# EAGLE design arduino_breakout (EAGLE 6.1)
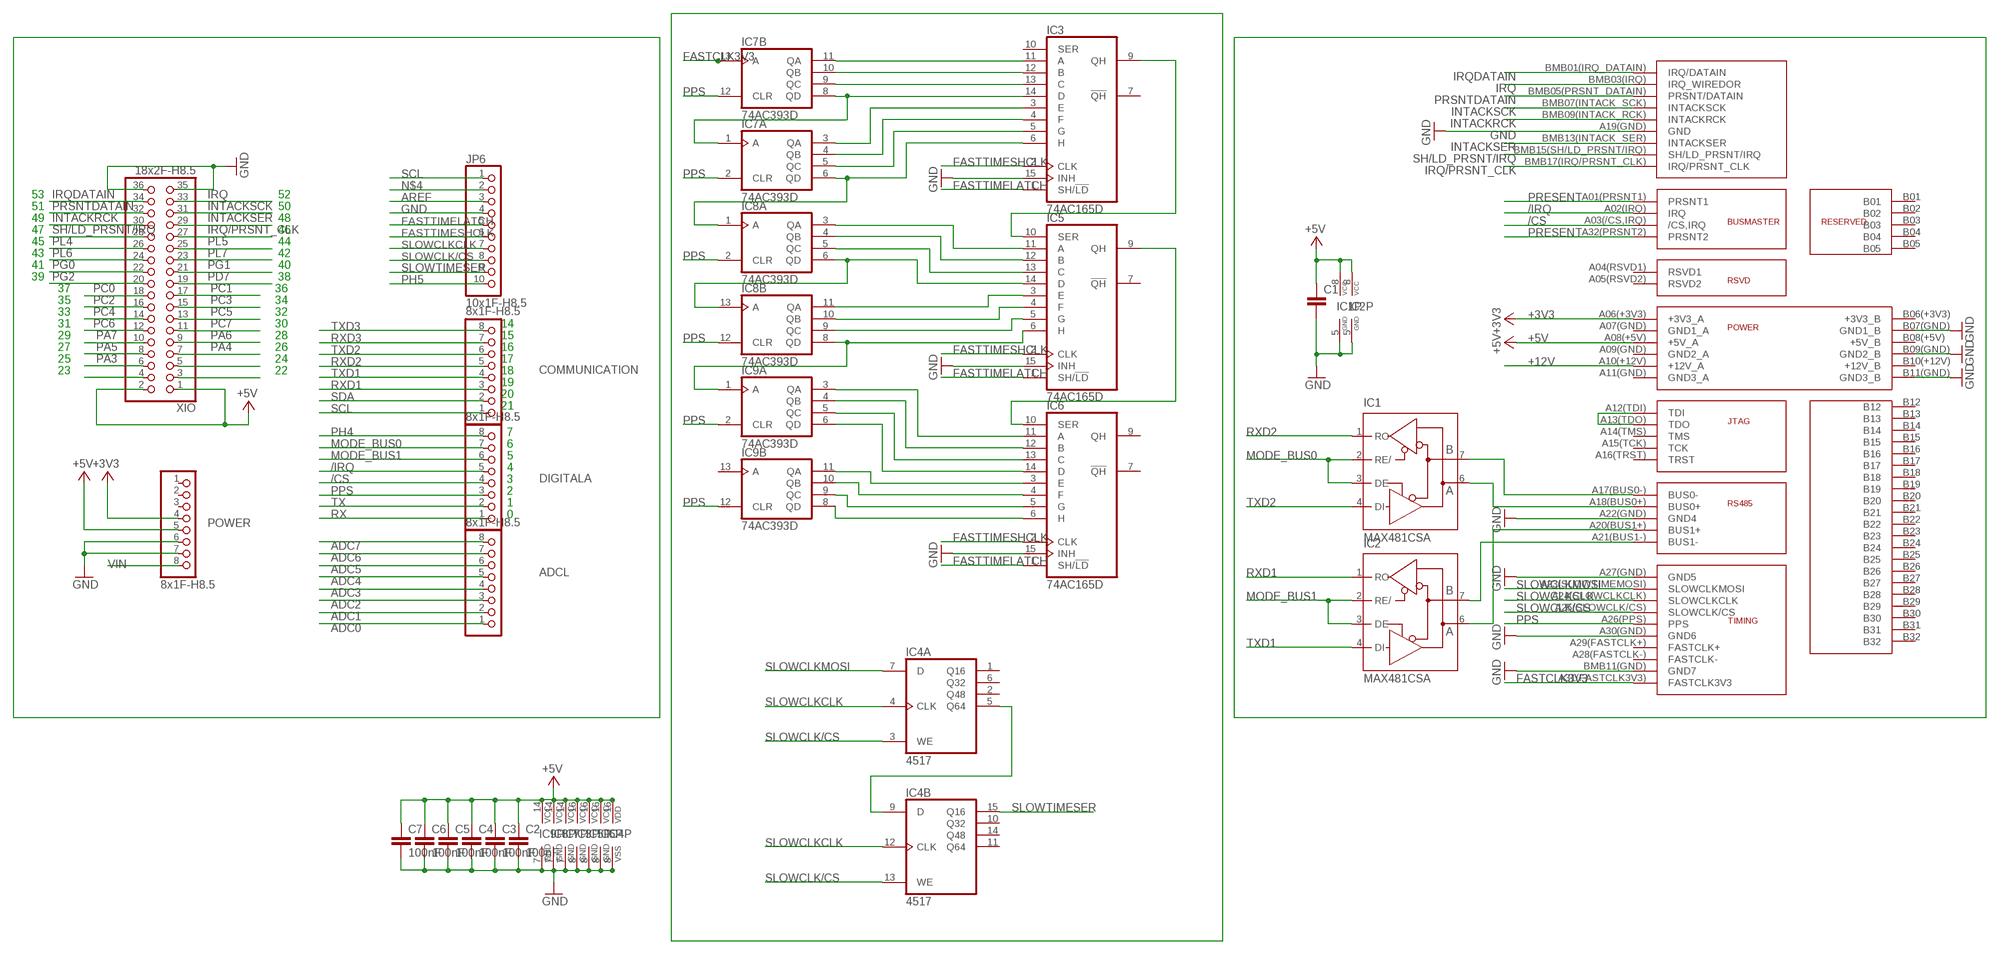
[diagram p0: schematic, sheet 1]

## Parts
ADCL  8x1F-H8.5  PINHD-1X8  [1X08]
C1  C-EUC0603  [C0603]
C2  100nF  C-EUC0603  [C0603]
C3  100nF  C-EUC0603  [C0603]
C4  100nF  C-EUC0603  [C0603]
C5  100nF  C-EUC0603  [C0603]
C6  100nF  C-EUC0603  [C0603]
C7  100nF  C-EUC0603  [C0603]
COMMUNICATION  8x1F-H8.5  PINHD-1X8  [1X08]
DIGITALA  8x1F-H8.5  PINHD-1X8  [1X08]
IC1  MAX481CSA  [SO08]
IC2  MAX481CSA  [SO08]
IC3  74AC165D  [SO16]
IC4  4517  [SO16]
IC5  74AC165D  [SO16]
IC6  74AC165D  [SO16]
IC7  74AC393D  [SO14]
IC8  74AC393D  [SO14]
IC9  74AC393D  [SO14]
JP6  10x1F-H8.5  PINHD-1X10_ARD  [1X10]
POWER  8x1F-H8.5  PINHD-1X8  [1X08]
U$1  BUSMASTER  [BUSMASTER_EDGE_CONNECTOR]
XIO  18x2F-H8.5  PINHD-2X18  [2X18]

## Nets
+3V3 [power]: POWER.4 U$1.A06(+3V3)(+3V3_A)
+5V [power usb]: C1.1 C2.1 C3.1 C4.1 C5.1 C6.1 C7.1 IC1.8(VCC) IC2.8(VCC) IC3.16(VCC) IC4.16(P:VDD) IC5.16(VCC) IC6.16(VCC) IC7.14(P:VCC) IC8.14(P:VCC) IC9.14(P:VCC) POWER.5 U$1.A08(+5V)(+5V_A) XIO.1 XIO.2
+12V [power usb]: U$1.A10(+12V)(+12V_A)
/CS: DIGITALA.4 U$1.A03(/CS,IRQ)(/CS,IRQ)
/IRQ: DIGITALA.5 U$1.A02(IRQ)(IRQ)
ADC0: ADCL.1
ADC1: ADCL.2
ADC2: ADCL.3
ADC3: ADCL.4
ADC4: ADCL.5
ADC5: ADCL.6
ADC6: ADCL.7
ADC7: ADCL.8
AREF: JP6.3
FASTCLK3V3: IC7.13(B:A) U$1.A31(FASTCLK3V3)(FASTCLK3V3)
FASTTIMELATCH: IC3.1(SH/!LD) IC5.1(SH/!LD) IC6.1(SH/!LD) JP6.5
FASTTIMESHCLK: IC3.2(CLK) IC5.2(CLK) IC6.2(CLK) JP6.6
GND [gnd]: C1.2 C2.2 C3.2 C4.2 C5.2 C6.2 C7.2 IC1.5(GND) IC2.5(GND) IC3.8(GND) IC3.15(INH) IC4.8(P:VSS) IC5.8(GND) IC5.15(INH) IC6.8(GND) IC6.15(INH) IC7.7(P:GND) IC8.7(P:GND) IC9.7(P:GND) JP6.4 POWER.6 POWER.7 U$1.A19(GND)(GND) U$1.A22(GND)(GND4) U$1.A27(GND)(GND5) U$1.A30(GND)(GND6) U$1.B07(GND)(GND1_B) U$1.B09(GND)(GND2_B) U$1.B11(GND)(GND3_B) U$1.BMB11(GND)(GND7) XIO.35 XIO.36
INTACKRCK: U$1.BMB09(INTACK_RCK)(INTACKRCK) XIO.30
INTACKSCK: U$1.BMB07(INTACK_SCK)(INTACKSCK) XIO.31
INTACKSER: U$1.BMB13(INTACK_SER)(INTACKSER) XIO.29
IRQ: U$1.BMB03(IRQ)(IRQ_WIREDOR) XIO.33
IRQ/PRSNT_CLK: U$1.BMB17(IRQ/PRSNT_CLK)(IRQ/PRSNT_CLK) XIO.27
IRQDATAIN: U$1.BMB01(IRQ_DATAIN)(IRQ/DATAIN) XIO.34
MODE_BUS0: DIGITALA.7 IC1.2(RE/) IC1.3(DE)
MODE_BUS1: DIGITALA.6 IC2.2(RE/) IC2.3(DE)
N$1: U$1.A12(TDI)(TDI) U$1.A13(TDO)(TDO)
N$2: IC1.7(B) U$1.A17(BUS0-)(BUS0-)
N$3: IC1.6(A) U$1.A18(BUS0+)(BUS0+)
N$4: JP6.2
N$5: IC2.7(B) U$1.A21(BUS1-)(BUS1-)
N$6: IC2.6(A) U$1.A20(BUS1+)(BUS1+)
N$10: IC7.1(A:A) IC7.8(B:QD)
N$11: IC3.13(C) IC7.9(B:QC)
N$12: IC3.12(B) IC7.10(B:QB)
N$13: IC3.11(A) IC7.11(B:QA)
N$14: IC3.3(E) IC7.3(A:QA)
N$15: IC3.4(F) IC7.4(A:QB)
N$16: IC3.5(G) IC7.5(A:QC)
N$17: IC3.6(H) IC7.6(A:QD) IC8.1(A:A)
N$18: XIO.5
N$19: IC6.6(H) IC9.8(B:QD)
N$20: IC6.5(G) IC9.9(B:QC)
N$21: IC6.4(F) IC9.10(B:QB)
N$22: IC6.3(E) IC9.11(B:QA)
N$23: IC6.14(D) IC9.6(A:QD)
N$24: IC6.13(C) IC9.5(A:QC)
N$25: IC6.12(B) IC9.4(A:QB)
N$26: IC6.11(A) IC9.3(A:QA)
N$27: IC5.6(H) IC8.8(B:QD) IC9.1(A:A)
N$28: IC5.5(G) IC8.9(B:QC)
N$29: IC5.4(F) IC8.10(B:QB)
N$30: IC5.3(E) IC8.11(B:QA)
N$31: IC5.14(D) IC8.6(A:QD) IC8.13(B:A)
N$32: IC5.13(C) IC8.5(A:QC)
N$33: IC4.5(A:Q64) IC4.9(B:D)
N$34: IC3.9(QH) IC5.10(SER)
N$35: IC5.12(B) IC8.4(A:QB)
N$36: IC5.9(QH) IC6.10(SER)
N$37: IC5.11(A) IC8.3(A:QA)
N$38: XIO.3
N$39: XIO.4
PA3: XIO.6
PA4: XIO.7
PA5: XIO.8
PA6: XIO.9
PA7: XIO.10
PC0: XIO.18
PC1: XIO.17
PC2: XIO.16
PC3: XIO.15
PC4: XIO.14
PC5: XIO.13
PC6: XIO.12
PC7: XIO.11
PD7: XIO.19
PG0: XIO.22
PG1: XIO.21
PG2: XIO.20
PH4: DIGITALA.8
PH5: JP6.10
PL4: XIO.26
PL5: XIO.25
PL6: XIO.24
PL7: XIO.23
PPS: DIGITALA.3 IC7.2(A:CLR) IC7.12(B:CLR) IC8.2(A:CLR) IC8.12(B:CLR) IC9.2(A:CLR) IC9.12(B:CLR) U$1.A26(PPS)(PPS)
PRESENT: U$1.A01(PRSNT1)(PRSNT1) U$1.A32(PRSNT2)(PRSNT2)
PRSNTDATAIN: U$1.BMB05(PRSNT_DATAIN)(PRSNT/DATAIN) XIO.32
RX: DIGITALA.1
RXD1: COMMUNICATION.3 IC2.1(RO)
RXD2: COMMUNICATION.5 IC1.1(RO)
RXD3: COMMUNICATION.7
SCL: COMMUNICATION.1 JP6.1
SDA: COMMUNICATION.2
SH/LD_PRSNT/IRQ: U$1.BMB15(SH/LD_PRSNT/IRQ)(SH/LD_PRSNT/IRQ) XIO.28
SLOWCLK/CS: IC4.3(A:WE) IC4.13(B:WE) JP6.8 U$1.A25(SLOWCLK/CS)(SLOWCLK/CS)
SLOWCLKCLK: IC4.4(A:CLK) IC4.12(B:CLK) JP6.7 U$1.A24(SLOWCLKCLK)(SLOWCLKCLK)
SLOWCLKMOSI: IC4.7(A:D) U$1.A23(SLOWTIMEMOSI)(SLOWCLKMOSI)
SLOWTIMESER: IC4.15(B:Q16) JP6.9
TX: DIGITALA.2
TXD1: COMMUNICATION.4 IC2.4(DI)
TXD2: COMMUNICATION.6 IC1.4(DI)
TXD3: COMMUNICATION.8
VIN [power]: POWER.8
Unconnected: IC3.7(!QH) IC3.10(SER) IC3.14(D) IC4.1(A:Q16) IC4.2(A:Q48) IC4.6(A:Q32) IC4.10(B:Q32) IC4.11(B:Q64) IC4.14(B:Q48) IC5.7(!QH) IC6.7(!QH) IC6.9(QH) IC9.13(B:A) POWER.1 POWER.2 POWER.3 U$1.A04(RSVD1)(RSVD1) U$1.A05(RSVD2)(RSVD2) U$1.A07(GND)(GND1_A) U$1.A09(GND)(GND2_A) U$1.A11(GND)(GND3_A) U$1.A14(TMS)(TMS) U$1.A15(TCK)(TCK) U$1.A16(TRST)(TRST) U$1.A28(FASTCLK-)(FASTCLK-) U$1.A29(FASTCLK+)(FASTCLK+) U$1.B01 U$1.B02 U$1.B03 U$1.B04 U$1.B05 U$1.B06(+3V3)(+3V3_B) U$1.B08(+5V)(+5V_B) U$1.B10(+12V)(+12V_B) U$1.B12 U$1.B13 U$1.B14 U$1.B15 U$1.B16 U$1.B17 U$1.B18 U$1.B19 U$1.B20 U$1.B21 U$1.B22 U$1.B23 U$1.B24 U$1.B25 U$1.B26 U$1.B27 U$1.B28 U$1.B29 U$1.B30 U$1.B31 U$1.B32

## Notes on the sheet
- 53 | 52
- 51 | 50
- 49 | 48
- 47 | 46
- 45 | 44
- 43 | 42
- 41 | 40
- 39 | 38
- 37 | 36
- 35 | 34
- 33 | 32
- 31 | 30 | 14
- 29 | 28 | 15
- 27 | 26 | 16
- 25 | 24 | 17
- 23 | 22 | 18
- 19
- 20
- 21
- 7
- 6
- 5
- 4
- 3
- 2
- 1
- 0

## Library data of the parts
ADCL COMMUNICATION DIGITALA POWER = SmartPrj:PINHD-1X8: PIN HEADER
C1-C7 = rcl:C-EU: CAPACITOR, European symbol
IC1 IC2 = maxim:MAX481CSA: RS485 TRANSEIVER; MF: MAXIM; MPN: MAX481CSA; OC_FARNELL: unknown; OC_NEWARK: 90C3817
IC3 IC5 IC6 = 74xx-eu:74*165: 8-bit parallel load SHIFT REGISTER
IC4 = 45xx:4517: Dual 64-bit static REGISTER
IC7-IC9 = 74xx-eu:74*393: Dual 4-bit decade and binary COUNTER
JP6 = SmartPrj:PINHD-1X10_ARD: PIN HEADER
U$1 = hgg:BUSMASTER
XIO = SmartPrj:PINHD-2X18: PIN HEADER

## Net classes
0 default: width 0.203 mm, drill 0.406 mm, clearance 0.203 mm
1 power: width 0.61 mm, drill 0.406 mm, clearance 0.203 mm
2 gnd: width 0.305 mm, drill 0.406 mm, clearance 0.203 mm
3 power usb: width 0.508 mm, drill 0.406 mm, clearance 0.203 mm

## Board
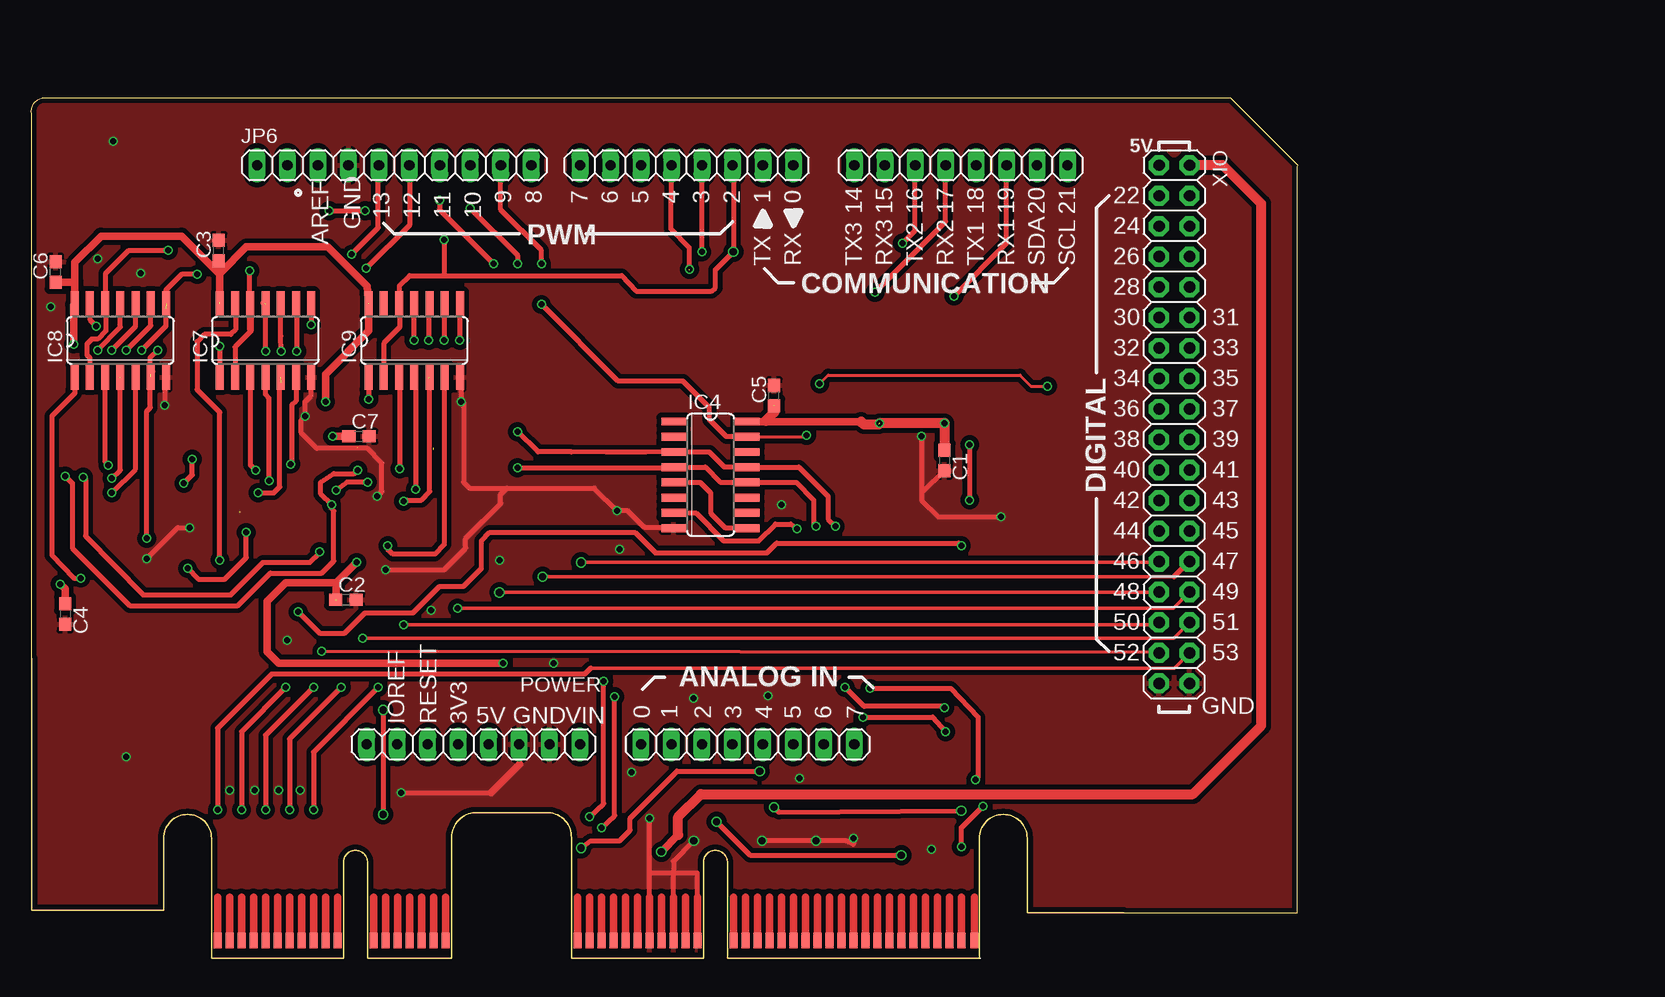
[diagram p1: board, top side]
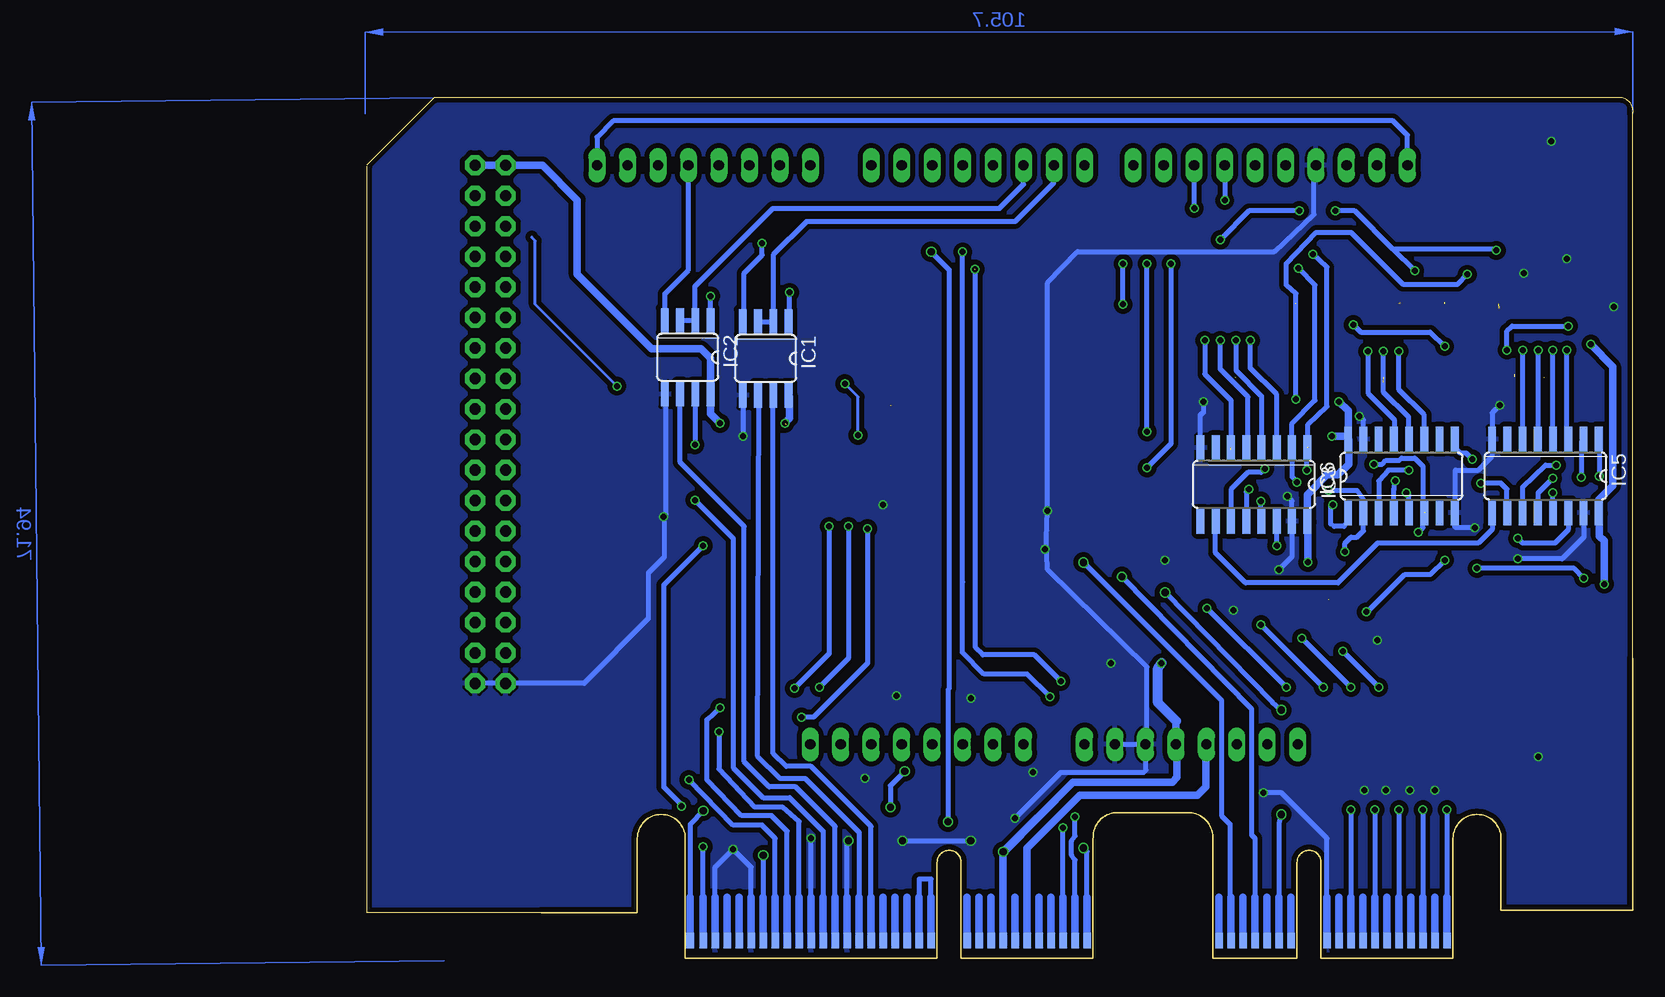
[diagram p2: board, bottom side, seen from below]

Size 105.57 x 71.74 mm. Coordinates in mm from the lower left corner, seen from the top.
Outline: 105.57,66.1 99.93,71.74 1.01,71.74 arc90 0.01,70.44 0.01,24.7
Outline: 90.61,3.8 105.51,3.8 105.51,66
Copper layers (1*16): Top 0.035mm / dielectric 1.5mm / Bottom 0.035mm
Design rules: minimum track width 0.125mm, minimum drill 0.2mm, track to track 0.125mm, track to pad 0.125mm, pad to pad 0.125mm, via to via 0.125mm, smd to smd 0.125mm, copper to edge 0.3mm, drill to drill 0.2mm, minimum pad ring 0.2mm, minimum via ring 0.125mm, stop-mask expansion 0.075mm, vias tented up to drill 0mil, thermal gap 0.2mm

### Footprints (pad centres in the part's own frame; a part is rotated, then mirrored left to right if it is on the bottom)
1X08 = drill 0.85 pad 1.422 long: 1 -8.89,0; 2 -6.35,0; 3 -3.81,0; 4 -1.27,0; 5 1.27,0; 6 3.81,0; 7 6.35,0; 8 8.89,0
C0603 = smd 1.1 x 1: 1 -0.85,0; 2 0.85,0
SO08 = smd 0.66 x 2.032: 1 -1.905,-3.073; 2 -0.635,-3.073; 3 0.635,-3.073; 4 1.905,-3.073; 5 1.905,3.073; 6 0.635,3.073; 7 -0.635,3.073; 8 -1.905,3.073
SO16 = smd 0.66 x 2.032: 1 -4.445,-3.073; 2 -3.175,-3.073; 3 -1.905,-3.073; 4 -0.635,-3.073; 5 0.635,-3.073; 6 1.905,-3.073; 7 3.175,-3.073; 8 4.445,-3.073; 9 4.445,3.073; 10 3.175,3.073; 11 1.905,3.073; 12 0.635,3.073; 13 -0.635,3.073; 14 -1.905,3.073; 15 -3.175,3.073; 16 -4.445,3.073
SO14 = smd 0.66 x 2.032: 1 -3.81,-3.073; 2 -2.54,-3.073; 3 -1.27,-3.073; 4 0,-3.073; 5 1.27,-3.073; 6 2.54,-3.073; 7 3.81,-3.073; 8 3.81,3.073; 9 2.54,3.073; 10 1.27,3.073; 11 0,3.073; 12 -1.27,3.073; 13 -2.54,3.073; 14 -3.81,3.073
1X10 = drill 0.85 pad 1.422 long: 1 -11.43,0; 2 -8.89,0; 3 -6.35,0; 4 -3.81,0; 5 -1.27,0; 6 1.27,0; 7 3.81,0; 8 6.35,0; 9 8.89,0; 10 11.43,0
BUSMASTER_EDGE_CONNECTOR = smd 0.66 x 1.27 bottom: A01(PRSNT1) 45.5,-14.5; A02(IRQ) 46.5,-14.5; A03(/CS,IRQ) 47.5,-14.5; A04(RSVD1) 48.5,-14.5; A05(RSVD2) 49.5,-14.5; A06(+3V3) 50.5,-14.5; A07(GND) 51.5,-14.5; A08(+5V) 52.5,-14.5; A09(GND) 53.5,-14.5; A10(+12V) 54.5,-14.5; A11(GND) 55.5,-14.5; A12(TDI) 58.5,-14.5; A13(TDO) 59.5,-14.5; A14(TMS) 60.5,-14.5; A15(TCK) 61.5,-14.5; A16(TRST) 62.5,-14.5; A17(BUS0-) 63.5,-14.5; A18(BUS0+) 64.5,-14.5; A19(GND) 65.5,-14.5; A20(BUS1+) 66.5,-14.5; A21(BUS1-) 67.5,-14.5; A22(GND) 68.5,-14.5; A23(SLOWTIMEMOSI) 69.5,-14.5; A24(SLOWCLKCLK) 70.5,-14.5; A25(SLOWCLK/CS) 71.5,-14.5; A26(PPS) 72.5,-14.5; A27(GND) 73.5,-14.5; A28(FASTCLK-) 74.5,-14.5; A29(FASTCLK+) 75.5,-14.5; A30(GND) 76.5,-14.5; A31(FASTCLK3V3) 77.5,-14.5; A32(PRSNT2) 78.6,-14.5; BMB01(IRQ_DATAIN) 15.5,-14.5; BMB02 16.5,-14.5; BMB03(IRQ) 17.5,-14.5; BMB04 18.5,-14.5; BMB05(PRSNT_DATAIN) 19.5,-14.5; BMB06 20.5,-14.5; BMB07(INTACK_SCK) 21.5,-14.5; BMB08 22.5,-14.5; BMB09(INTACK_RCK) 23.5,-14.5; BMB10 24.5,-14.5; BMB11(GND) 25.5,-14.5; BMB12 28.5,-14.5; BMB13(INTACK_SER) 29.5,-14.5; BMB14 30.5,-14.5; BMB15(SH/LD_PRSNT/IRQ) 31.5,-14.5; BMB16 32.5,-14.5; BMB17(IRQ/PRSNT_CLK) 33.5,-14.5; BMB18 34.5,-14.5 | smd 0.66 x 1.27: B01 45.5,-14.5; B02 46.5,-14.5; B03 47.5,-14.5; B04 48.5,-14.5; B05 49.5,-14.5; B06(+3V3) 50.5,-14.5; B07(GND) 51.5,-14.5; B08(+5V) 52.5,-14.5; B09(GND) 53.5,-14.5; B10(+12V) 54.5,-14.5; B11(GND) 55.5,-14.5; B12 58.5,-14.5; B13 59.5,-14.5; B14 60.5,-14.5; B15 61.5,-14.5; B16 62.5,-14.5; B17 63.5,-14.5; B18 64.5,-14.5; B19 65.5,-14.5; B20 66.5,-14.5; B21 67.5,-14.5; B22 68.5,-14.5; B23 69.5,-14.5; B24 70.5,-14.5; B25 71.5,-14.5; B26 72.5,-14.5; B27 73.5,-14.5; B28 74.5,-14.5; B29 75.5,-14.5; B30 76.5,-14.5; B31 77.5,-14.5; B32 78.6,-14.5; BMA01 15.5,-14.5; BMA02 16.5,-14.5; BMA03 17.5,-14.5; BMA04 18.5,-14.5; BMA05 19.5,-14.5; BMA06 20.5,-14.5; BMA07 21.5,-14.5; BMA08 22.5,-14.5; BMA09 23.5,-14.5; BMA10 24.5,-14.5; BMA11 25.5,-14.5; BMA12 28.5,-14.5; BMA13 29.5,-14.5; BMA14 30.5,-14.5; BMA15 31.5,-14.5; BMA16 32.5,-14.5; BMA17 33.5,-14.5; BMA18 34.5,-14.5
2X18 = drill 0.95 pad 1.676 octagon: 1 -21.59,-1.27; 2 -21.59,1.27; 3 -19.05,-1.27; 4 -19.05,1.27; 5 -16.51,-1.27; 6 -16.51,1.27; 7 -13.97,-1.27; 8 -13.97,1.27; 9 -11.43,-1.27; 10 -11.43,1.27; 11 -8.89,-1.27; 12 -8.89,1.27; 13 -6.35,-1.27; 14 -6.35,1.27; 15 -3.81,-1.27; 16 -3.81,1.27; 17 -1.27,-1.27; 18 -1.27,1.27; 19 1.27,-1.27; 20 1.27,1.27; 21 3.81,-1.27; 22 3.81,1.27; 23 6.35,-1.27; 24 6.35,1.27; 25 8.89,-1.27; 26 8.89,1.27; 27 11.43,-1.27; 28 11.43,1.27; 29 13.97,-1.27; 30 13.97,1.27; 31 16.51,-1.27; 32 16.51,1.27; 33 19.05,-1.27; 34 19.05,1.27; 35 21.59,-1.27; 36 21.59,1.27

### Placement (x,y rotation side)
ADCL  59.7,17.84 0 top
C1  76.11,41.5 270 top
C2  26.21,29.9 0 top
C3  15.61,59 90 top
C4  2.81,28.7 270 top
C5  61.91,46.9 90 top
C6  2.01,57.2 90 top
C7  27.31,43.5 0 top
COMMUNICATION  77.48,66.1 180 top
DIGITALA  54.62,66.1 180 top
IC1  72.31,50 180 bottom
IC2  78.81,50.1 180 bottom
IC3  19.31,40.2 0 bottom
IC4  56.61,40.3 270 top
IC5  7.31,40.2 180 bottom
IC6  31.61,39.5 180 bottom
IC7  19.51,51.5 0 top
IC8  7.41,51.5 0 top
IC9  31.91,51.5 0 top
JP6  30.23,66.1 0 top
POWER  36.84,17.84 0 top
U$1  0.01,16 0 top
XIO  95.26,44.51 270 top

### Tracks (layer width: path | path; a pad name or v marks a point on that pad's centre or on a via)
+3V3
  Bottom 0.61: POWER.4 35.61,17.8 35.61,14.3 36.31,13.6 46.11,13.6 50.51,9.2 U$1.A06(+3V3)
+5V  (via drill 0.5, 0.6)  (5 unrouted)
  Top 0.61: v52.51,8.9 53.91,10.3 | 69.16,44.74 IC4.16 61.16,44.74 61.21,44.7 61.21,44.8 | v39.31,24.6 20.61,24.6 19.66,25.55 19.66,29.75 21.21,31.3 25.41,31.3 | v3.51,51.2 3.51,54.48 IC8.14 3.61,54.58 3.61,56.4 | 3.61,56.4 3.61,58 5.81,60.2 12.51,60.2 15.71,57 | 15.71,57 15.71,54.7 | 15.71,57 15.71,57.1 15.76,57.15 | 15.76,57.15 17.91,59.3 24.71,59.3 28,56.01 IC9.14 | v24.51,46.4 24.51,48.7 28.11,52.3 28.11,54.6 | 25.41,31.3 v27.11,33 | 25.41,31.3 25.41,29.9 25.31,29.8 25.21,29.9 | C3.1 15.61,57.3 15.76,57.15 | C4.1 2.81,30.8 v2.41,31.2 | C6.1 3.56,56.35 3.61,56.4 | C7.1 v25.11,43.5
  Top 0.813: 53.91,10.3 53.91,11.8 55.81,13.7 96.81,13.7 102.51,19.4 102.51,62.9 99.31,66.1 XIO.2 | C1.1 v76.11,44.6 v70.71,44.6 | 69.16,44.74 69.41,44.5 70.61,44.5 | 61.21,44.8 61.91,45.5 61.91,46.1
  Bottom 0.61: 46.71,14.7 38.41,14.7 38.01,15.1 38.01,17.74 POWER.5 38.11,19.8 | 46.71,14.7 v52.51,8.9 | v52.51,8.9 U$1.A08(+5V) | XIO.2 XIO.1 90.91,66.1 88.01,63.2 88.01,57 81.81,50.8 77.71,50.8 76.91,50 IC2.8 76.9,45.39 v76.11,44.6 | 46.71,14.7 52.41,8.9 v52.51,8.9 | IC1.8 70.4,46.91 70.31,46.8 70.31,45 v70.71,44.6 | v3.51,51.2 1.71,49.3 1.71,39.4 2.86,38.24 IC5.16 2.81,37.07 2.81,35.2 2.41,34.8 v2.41,31.2 | IC3.16 23.71,43.23 23.71,41.2 24.61,40.3 25.51,40.3 27.16,38.64 IC6.16 27.11,36.37 v27.11,33 | IC3.16 23.75,45.64 v24.51,46.4 | v25.11,43.5 23.98,43.5 IC3.16
  Bottom 0.813: 38.11,19.8 39.61,21.3 39.61,24.2 v39.31,24.6
/CS  (via drill 0.5)
  Top 0.406: v47.51,10.9 48.61,11.9 v48.61,21.8 | v55.89,58.88 DIGITALA.4
  Bottom 0.406: U$1.A03(/CS,IRQ) v47.51,10.9 | v55.89,58.88 55.91,54.5 55.89,31.38 55.91,27 55.91,25.5 54.11,23.7 50.51,23.7 v48.61,21.8
/IRQ  (via drill 0.5)  (1 unrouted)
  Top 0.406: v46.51,11.8 47.71,12.9 v47.71,23.1 | v54.85,57.44 54.85,59.24 53.31,60.8 DIGITALA.5
  Bottom 0.406: U$1.A02(IRQ) 46.51,8.2 46.81,8.6 46.81,9.8 46.51,10.2 v46.51,11.8 | v47.71,23.1 49.91,25.3 54.21,25.3 54.81,25.9 54.81,57.4
ADC4
  Bottom 0.203: 60.97,17.74 ADCL.5
FASTCLK3V3  (via drill 0.5)
  Top 0.406: v77.51,9.3 77.51,10.9 v79.31,12.7 | v77.51,34.4 77.31,34.6 62.11,34.6 61.31,33.8 52.01,33.8 50.31,35.5 38.21,35.5 37.51,34.8 37.51,32.5 36.01,31 34.01,31 31.81,28.8 27.81,28.8 26.11,27.1 24.01,27.1 v22.23,28.88 | v15.71,33.2 15.71,45.5 13.81,47.4 13.81,51.4 14.41,52 16.61,52 17.01,52.4 17.01,54.53 IC7.13
  Bottom 0.406: U$1.A31(FASTCLK3V3) v77.51,9.3 | v79.31,12.7 79.31,12.8 80.81,14.3 80.81,31.1 v77.51,34.4 | v22.23,28.88 22.13,28.88 19.01,32 16.91,32 v15.71,33.2
FASTTIMELATCH  (via drill 0.5)  (1 unrouted)
  Top 0.406: v27.21,40.7 26.91,40.4 25.21,40.4 24.11,39.7 24.11,38.7 v25.01,37.8 25.01,37.5 25.21,37.3 25.21,33.1 24.21,32.1 19.91,32.1 17.21,29.4 8.21,29.4 3.41,34.2 3.41,39.6 v2.81,40.2 | v26.71,58.7 28.91,60.9 28.91,66.04 JP6.5
  Bottom 0.406: IC3.1 23.75,36.35 24.11,36 24.91,36 25.21,36.2 25.21,37.6 v25.01,37.8 | v27.21,40.7 27.21,42.5 27.01,42.5 27.11,42.6 27.11,44.5 25.51,46 25.51,57.6 v26.71,58.7 | IC5.1 2.81,43.22 v2.81,40.2
FASTTIMESHCLK  (via drill 0.5)
  Top 0.406: v28.01,39.7 26.31,39.7 v25.41,39 | JP6.6 31.5,61.1 v27.91,57.5 | v4.31,40.1 4.51,39.9 4.51,35.2 9.31,30.3 16.61,30.3 19.31,33 23.21,33 24.01,33.8 v24.01,33.9
  Bottom 0.406: v28.01,39.7 28.43,40.12 IC6.2 28.43,44.57 26.51,46.5 26.51,56.1 v27.91,57.5 | v25.41,39 23.01,39 22.51,38.3 22.51,37.15 IC3.2 22.48,35.62 23.01,35.1 23.51,35.1 24.01,34.6 v24.01,33.9 | IC5.2 4.31,43.1 v4.31,40.1
GND  (via drill 0.5, 0.6)
  Top 0.406: U$1.B07(GND) 51.51,7.1 | 51.51,7.1 v51.51,11.7 | U$1.B09(GND) 53.51,7.1 | 53.51,7.1 51.51,7.1 | U$1.B11(GND) 55.51,7.1 53.51,7.1 | v74.21,43.5 74.21,38.75 | v80.81,36.8 75.61,36.8 74.21,38.2 74.21,38.75 | C1.2 74.21,38.75 | v30.81,13.8 38.31,13.8 | 40.71,16.2 40.71,17.8 | v55.21,9.8 53.51,8.1 53.51,7.1 | v60.91,9.8 v65.41,9.8 67.91,9.8 68.51,9.5 v68.51,10 | IC8.7 11.11,48.32 v11.11,46.1 | IC9.7 35.81,48.34 v35.81,46.4 | 53.49,35.9 51.11,35.9 49.71,37.3 v48.81,37.3 46.91,39.2 39.61,39.2 | 36.01,46.3 36.01,39.7 36.51,39.2 39.61,39.2 | v29.51,32.4 34.41,32.4 36.21,34.2 36.21,35 39.11,37.9 39.11,38.7 39.61,39.2 | IC7.7 23.31,48.42 23.31,46.9 22.81,46.4 v22.81,45.2 22.48,44.88 22.48,43.8 23.78,42.5 28.01,42.5 29.21,41.3 29.21,38.9 v28.81,38.5 | v9.61,33.3 12.21,35.9 v13.21,35.9
  Top 0.61: 38.31,13.8 40.71,16.2 | IC4.8 53.49,35.9
  Bottom 0.406: v51.51,11.7 47.71,15.5 40.81,15.5 40.61,15.7 40.61,17.8 | POWER.7 POWER.6 40.51,17.98 40.51,24.28 48.81,32.4 48.91,35 v48.81,37.3 48.81,56.3 46.31,58.9 29.91,58.9 26.61,62 26.61,66.2 | XIO.36 XIO.35 87.43,22.92 82.11,28.3 82.11,32.1 80.76,33.45 80.76,36.75 v80.81,36.8 | IC1.5 v74.21,43.5 74.21,43.4 | v80.81,36.8 80.71,36.89 | v80.81,36.8 80.61,37 80.61,47 | U$1.BMB11(GND) 25.51,10 29.31,13.8 v30.81,13.8 | v60.91,9.8 v55.21,9.8 | U$1.A19(GND) 65.51,9.6 v65.41,9.8 | U$1.A22(GND) v68.51,10 | v11.11,46.1 11.75,45.45 IC5.8 11.75,41.85 12.91,40.7 14.81,40.7 14.81,37.18 IC3.8 14.86,36.05 14.81,35.9 v13.21,35.9 | IC6.8 36.05,45.35 | v29.51,32.4 28.43,33.48 IC6.15 28.43,38.12 v28.81,38.5 | 22.51,43.25 IC3.15 22.48,44.88 v22.81,45.2 | IC5.15 4.11,37.1 4.11,35.1 5.91,33.3 v9.61,33.3 | v35.81,46.4 35.81,45.5 36.01,45.3 | U$1.A30(GND) 76.51,7.6 v75.01,9.1 73.51,7.6 U$1.A27(GND)
  other vias: 6.81,68.1 1.61,54.3 7.91,16.8 39.01,33.2 49.01,34.1 61.41,21.9 55.21,21.7 50.01,15.5 16.51,14 18.61,14 20.61,14 22.41,14 62.51,37.8 21.31,26.5 9.11,57.1 5.51,58.3 33.31,29 43.51,24.6 64.01,15
  pour Top (isolate 0.406): -11.99,78.3 108.71,78.5 108.81,-8.2 -13.99,-8.4 -14.29,78.2
  pour Bottom (isolate 0.406): -0.79,94.1 116.81,95.3 116.81,-20 -4.49,-20.9 -4.59,90.8 -3.39,93.6 -3.39,94.5 -1.99,94.6
INTACKRCK  (via drill 0.5)
  Top 0.305: XIO.30 95.19,29.2 v35.51,29.2
  Top 0.406: v28.91,22.6 23.51,17.2 v23.51,12.4
  Bottom 0.406: v35.51,29.2 v28.91,22.6 | v23.51,12.4 U$1.BMB09(INTACK_RCK)
INTACKSCK  (via drill 0.5)
  Top 0.305: 93.79,27.8 v31.01,27.8
  Top 0.406: XIO.31 93.79,27.8 | v25.81,22.6 21.51,18.3 v21.51,12.4
  Bottom 0.406: v31.01,27.8 v25.81,22.6 | v21.51,12.4 U$1.BMB07(INTACK_SCK)
INTACKSER  (via drill 0.6)
  Top 0.305: 93.95,30.5 v39.01,30.5
  Top 0.406: XIO.29 93.95,30.5 | v29.31,20.7 v29.31,12
  Bottom 0.406: v39.01,30.5 30.11,21.4 v29.31,20.7 | v29.31,12 29.51,11.3 U$1.BMB13(INTACK_SER)
IRQ  (via drill 0.5)
  Top 0.305: 93.95,25.5 v24.21,25.6
  Top 0.406: XIO.33 93.95,25.5 | v21.21,22.6 17.51,18.9 v17.51,12.4
  Bottom 0.406: v24.21,25.6 v21.21,22.6 | v17.51,12.4 U$1.BMB03(IRQ)
IRQ/PRSNT_CLK  (via drill 0.6)
  Top 0.305: 93.91,33 v45.81,33
  Top 0.406: XIO.27 93.91,33
  Bottom 0.406: v45.81,33 34.31,21.5 34.31,11.9 33.61,11.2 33.61,1.5 U$1.BMB17(IRQ/PRSNT_CLK)
IRQDATAIN  (via drill 0.5)
  Top 0.305: XIO.34 95.27,24.2 46.61,24.2
  Top 0.406: 46.61,24.2 46.11,23.7 20.01,23.7 15.51,19.2 v15.51,12.4
  Bottom 0.406: v15.51,12.4 U$1.BMB01(IRQ_DATAIN)
MODE_BUS0
  Bottom 0.406: IC1.3 IC1.2 71.67,58.63 68.91,61.4 51.51,61.4 48.31,64.6 48.31,66.06 DIGITALA.7
MODE_BUS1
  Bottom 0.406: IC2.3 IC2.2 78.21,53.21 78.21,56 71.71,62.5 52.81,62.5 50.81,64.5 DIGITALA.6
N$1
  Bottom 0.406: U$1.A12(TDI) 58.51,6.6 59.51,6.6 U$1.A13(TDO)
N$2
  Bottom 0.406: U$1.A17(BUS0-) 63.51,11 68.51,16 70.61,16 71.67,17.06 IC1.7
N$3
  Bottom 0.406: IC1.6 72.91,46.89 73.01,16.9 71.11,15 69.01,15 64.51,10.5 U$1.A18(BUS0+)
N$5  (via drill 0.5)
  Top 0.406: v78.21,42.8 v78.21,38.2
  Bottom 0.406: IC2.7 78.21,46.99 v78.21,42.8 | v78.21,38.2 75.01,35 75.01,15.9 72.51,13.4 70.31,13.4 67.51,10.6 U$1.A21(BUS1-)
N$6
  Bottom 0.406: U$1.A20(BUS1+) 66.51,11 69.81,14.3 72.01,14.3 74.11,16.4 74.11,36 79.44,41.34 IC2.6
N$10  (via drill 0.5)
  Top 0.406: IC7.8 23.32,53.21 v23.31,52.8 | v15.71,51 IC7.1
  Bottom 0.406: v23.31,52.8 22.71,52.2 16.91,52.2 v15.71,51
N$11  (via drill 0.5)
  Top 0.406: IC7.9 22.11,54.51 v22.11,50.6
  Bottom 0.406: v22.11,50.6 22.11,47.1 19.91,44.9 19.91,43.31 IC3.13
N$12  (via drill 0.5)
  Top 0.406: v20.81,50.6 20.78,51.87 IC7.10
  Bottom 0.406: IC3.12 18.71,43.31 18.71,45.1 20.81,47.2 v20.81,50.6
N$13  (via drill 0.5)  (1 unrouted)
  Top 0.406: v19.51,50.6 19.51,54.4 19.31,54.6 19.41,54.6
  Bottom 0.406: IC3.11 17.41,45.3 19.51,47.4 v19.51,50.6
N$14  (via drill 0.5)
  Top 0.406: IC7.3 18.24,41.13 v18.71,40.7
  Bottom 0.406: v18.71,40.7 20.41,40.7 21.21,39.8 IC3.3
N$15  (via drill 0.5)
  Top 0.406: v19.81,39.8 19.81,46.7 19.51,47 IC7.4
  Bottom 0.406: IC3.4 19.94,39.06 v19.81,39.8
N$16  (via drill 0.5)  (1 unrouted)
  Top 0.406: v18.91,38.8 20.21,38.8 20.71,39.3 20.71,47.9 20.81,48
  Bottom 0.406: IC3.5 18.67,38.56 v18.91,38.8
N$17  (via drill 0.5)  (1 unrouted)
  Top 0.406: IC8.1 3.61,48.42 3.61,47.1 1.71,45.2 1.71,33.6 3.51,31.7 v4.11,31.7 | v13.01,32.5 13.91,31.6 16.11,31.6 17.91,33.4 v17.91,35.5 | IC7.6 22.05,46.44 21.71,46.1 21.71,41.3 v21.61,41.2
  Bottom 0.406: v4.11,31.7 4.91,32.5 v13.01,32.5 | v17.91,35.5 17.51,35.9 17.51,37.3 17.41,37.2 | 17.41,37.2 17.41,37.1 | v21.61,41.2 20.91,41.2 20.61,41.5 19.51,41.5 19.31,41.7 18.21,41.7 17.51,41 17.51,37.4 17.31,37.2 | IC3.6 17.4,37.2 17.41,37.2
N$19  (via drill 0.5)  (1 unrouted)
  Top 0.406: IC9.8 v35.71,51.5
  Bottom 0.406: v35.71,51.5 35.71,48.7 33.51,46.5 33.51,42.4
N$20  (via drill 0.5)
  Top 0.406: v34.41,51.5 34.45,51.64 IC9.9
  Bottom 0.406: IC6.5 32.11,42.71 32.11,46.8 34.41,49.1 v34.41,51.5
N$21  (via drill 0.5)
  Top 0.406: IC9.10 33.11,54.5 v33.11,51.5
  Bottom 0.406: v33.11,51.5 33.11,49 30.97,46.87 IC6.4
N$22  (via drill 0.5)
  Top 0.406: v31.91,51.5 IC9.11
  Bottom 0.406: IC6.3 29.71,47 31.91,49.2 v31.91,51.5
N$23  (via drill 0.5)
  Top 0.406: IC9.6 34.41,48.39 34.41,34.5 33.61,33.7 30.11,33.7 29.71,34.1 v29.71,34.4
  Bottom 0.406: IC6.14 v29.71,34.4
N$24  (via drill 0.5)  (1 unrouted)
  Top 0.406: v31.01,38.1 31.31,38.2 32.51,38.2 33.21,38.9 33.21,48.5 33.11,48.4 33.11,48.2
  Bottom 0.406: IC6.13 31.01,36.46 v31.01,38.1
N$25  (via drill 0.5)
  Top 0.406: IC9.4 32.01,48.33 v32.01,39.1
  Bottom 0.406: v32.01,39.1 32.24,38.87 IC6.12
N$26  (via drill 0.5)
  Top 0.406: IC9.3 30.71,48.36 v30.71,40.8
  Bottom 0.406: v30.71,40.8 31.01,40.5 32.11,40.5 33.51,39.09 IC6.11
N$27  (via drill 0.5)  (1 unrouted)
  Top 0.406: v9.21,50.7 11.22,52.71 IC8.8 | IC9.1 v28.1,46.61 v28.11,46.6 | v13.81,57 12.51,57 11.21,55.7 11.21,54.2
  Bottom 0.406: IC5.6 v9.21,50.7 | v28.11,46.6 28.11,55.4 28.91,56.1 28.91,57.9 26.41,60.5 23.51,60.5 19.21,56.2 14.61,56.2 v13.81,57
N$28  (via drill 0.5)
  Top 0.406: v7.91,50.7 9.95,52.74 IC8.9
  Bottom 0.406: IC5.5 7.91,43.31 v7.91,50.7
N$29  (via drill 0.5)
  Top 0.406: v6.71,50.7 8.68,52.67 IC8.10
  Bottom 0.406: IC5.4 6.71,43.31 v6.71,50.7
N$30  (via drill 0.5)
  Top 0.406: v5.51,50.7 7.41,52.6 IC8.11
  Bottom 0.406: IC5.3 5.51,43.38 v5.51,50.7
N$31  (via drill 0.5)  (1 unrouted)
  Top 0.406: IC8.6 9.91,48.47 9.91,50.1 v10.51,50.7 | v5.41,52.7 4.91,53.2 4.91,53.9 4.87,54.06 IC8.13 | v9.61,35 9.61,45.6 9.91,45.9 9.91,48.7 10.11,48.9
  Bottom 0.406: v10.51,50.7 10.51,52.3 10.11,52.7 v5.41,52.7 | IC5.14 5.4,35.7 6.51,34.6 9.21,34.6 v9.61,35
N$32  (via drill 0.5)
  Top 0.406: v6.71,38.8 8.68,40.77 IC8.5
  Bottom 0.406: IC5.13 6.71,37.16 v6.71,38.8
N$33
  Top 0.406: IC4.5 55.74,39.66 56.61,38.8 56.61,37.1 57.81,35.9 59.64,35.9 IC4.9
N$34  (via drill 0.5)
  Top 0.406: v12.71,39.6 13.41,40.3 v13.41,41.6
  Bottom 0.406: IC5.10 10.51,37.15 10.51,39.1 11.01,39.6 v12.71,39.6 | v13.41,41.6 13.91,42.1 14.41,42.1 14.86,42.55 IC3.9
N$35  (via drill 0.5)  (1 unrouted)
  Top 0.406: v6.71,40 7.41,40.7 7.41,48.4 7.51,48.4
  Bottom 0.406: IC5.12 7.91,37.16 7.91,38.8 v6.71,40
N$36
  Bottom 0.406: IC5.9 11.75,35.75 12.91,34.6 21.31,34.6 24.61,31.3 32.31,31.3 34.81,33.8 34.81,36.4 IC6.10
N$37  (via drill 0.5)
  Top 0.406: v6.41,41.1 6.14,41.43 IC8.3
  Bottom 0.406: IC5.11 9.21,39.3 7.31,41.1 v6.41,41.1
PPS  (via drill 0.5, 0.6)
  Top 0.406: DIGITALA.3 58.51,66.02 v58.51,58.9 57.01,57.4 57.01,55.9 56.71,55.6 50.41,55.6 49.21,56.9 34.41,56.9 | v57.11,11.4 59.91,8.6 v72.51,8.6 | IC8.12 6.21,54.5 | 6.21,54.5 6.21,52.3 5.51,51.6 5.01,51.6 4.61,51.2 4.61,50.3 4.87,50.04 IC8.2 | IC9.12 30.71,54.5 | 30.71,54.5 30.71,52.6 29.37,51.26 IC9.2 | IC7.12 18.31,54.5 18.31,52.3 | 18.31,52.3 16.97,50.96 IC7.2 | 30.71,54.5 30.71,56.1 31.51,56.9 34.41,56.9 | 18.31,52.3 18.21,52.4 v18.21,57.3 | v24.81,62.3 v27.81,62.3 | v34.41,59.9 34.41,56.9 | 6.21,54.5 6.21,57.1 8.11,59 v11.41,59
  Bottom 0.406: v58.51,58.9 57.01,57.4 57.01,22.5 57.11,22.4 v57.11,11.4 | v72.51,8.6 U$1.A26(PPS) | v18.21,57.3 20.01,59.1 | 20.01,59.1 23.21,62.3 v24.81,62.3 | v27.81,62.3 32.01,62.3 v34.41,59.9 | v11.41,59 11.51,59.1 20.01,59.1
PRESENT  (via drill 0.6)
  Top 0.406: v45.81,9.2 46.61,9.8 49.01,9.8 49.91,10.7 49.91,11.7 53.81,15.6 v60.71,15.6 | v61.91,12.6 62.31,12.2 v77.51,12.3
  Bottom 0.406: U$1.A01(PRSNT1) 45.51,8.9 v45.81,9.2 | v60.71,15.6 61.91,14.4 v61.91,12.6 | v77.51,12.3 78.61,11.2 U$1.A32(PRSNT2)
PRSNTDATAIN  (via drill 0.5)
  Top 0.305: XIO.32 95.23,26.7 v27.61,26.7
  Top 0.406: v23.51,22.6 19.51,18.6 v19.51,12.4
  Bottom 0.406: v27.61,26.7 v23.51,22.6 | v19.51,12.4 U$1.BMB05(PRSNT_DATAIN)
RXD1  (via drill 0.5)
  Top 0.406: v76.91,55.2 81.29,59.58 COMMUNICATION.3
  Bottom 0.406: IC2.1 v76.91,55.2
RXD2  (via drill 0.5)
  Top 0.406: v70.31,55.5 76.21,61.4 COMMUNICATION.5
  Bottom 0.406: IC1.1 70.31,53.17 v70.31,55.5
SCL
  Bottom 0.406: JP6.1 18.9,66 19.11,66 18.81,66.3 18.81,68.6 20.01,69.8 85.01,69.8 86.37,68.44 COMMUNICATION.1
SH/LD_PRSNT/IRQ  (via drill 0.6)
  Top 0.305: 95.25,31.8 v42.61,31.8
  Top 0.406: XIO.28 95.25,31.8
  Bottom 0.406: v42.61,31.8 31.81,20.8 31.81,10.3 31.51,10 U$1.BMB15(SH/LD_PRSNT/IRQ)
SLOWCLK/CS  (via drill 0.5)
  Top 0.406: v67.01,36 66.41,36.6 66.41,38.5 63.97,40.93 IC4.13 57.77,40.93 56.51,42.2 IC4.3 51.21,42.2 47.91,42.2 45.01,42.2 42.21,42.2 v40.51,43.9 | v69.91,22.5 76.61,22.5 78.91,20.1 78.91,15.1 v78.71,14.9 | v36.58,62.52 40.51,58.6 v40.51,57.9
  Bottom 0.406: v67.01,36 67.01,25.4 v69.91,22.5 | U$1.A25(SLOWCLK/CS) 71.51,10 72.61,11.1 75.01,11.1 v78.71,14.9 | v40.51,43.9 v40.51,57.9 | v36.58,62.52 JP6.8
SLOWCLKCLK  (via drill 0.5)
  Top 0.406: v65.41,36 65.21,36.2 65.21,38.2 63.74,39.66 IC4.12 59.65,39.7 57.41,39.7 56.17,40.93 IC4.4 53.5,40.9 v40.51,40.9 | v76.11,20.9 76.11,21 69.41,21 v67.81,22.6 | v38.51,57.9 34.01,62.4 34.01,63.13 v34.04,63.16
  Bottom 0.406: v65.41,36 65.41,25 v67.81,22.6 | U$1.A24(SLOWCLKCLK) 70.51,10.6 71.81,11.9 74.31,11.9 77.21,14.9 77.21,19.9 v76.11,20.9 | JP6.7 v34.04,63.16 | v38.51,57.9 38.51,42.9 v40.51,40.9
SLOWCLKMOSI  (via drill 0.5)
  Top 0.406: IC4.7 55.38,37.12 57.71,34.8 60.61,34.8 62.01,36.2 63.31,36.2 v63.81,35.8 | v69.31,20.1 75.11,20.1 v76.21,18.9
  Bottom 0.406: v63.81,35.8 63.81,24.6 68.31,20.1 v69.31,20.1 | U$1.A23(SLOWTIMEMOSI) 69.51,11.4 70.91,12.6 73.21,12.6 76.21,15.8 v76.21,18.9
SLOWTIMESER  (via drill 0.5)
  Top 0.254: IC4.15 64.48,43.48 v64.61,43.6 | v65.71,47.9 66.41,48.6 82.41,48.6 83.31,47.7 v84.71,47.7
  Top 0.406: IC4.15 57.93,43.48 56.51,44.9 56.51,45.9 54.31,48.1 48.91,48.1 v42.51,54.5 | v42.51,57.9 42.51,59 39.11,62.4 39.11,66.08 JP6.9
  Bottom 0.254: v64.61,43.6 64.61,46.8 v65.71,47.9 | v84.71,47.7 91.51,54.5 91.51,59.8 91.81,60.1
  Bottom 0.406: v42.51,54.5 v42.51,57.9
TXD1
  Bottom 0.406: IC2.4 80.71,55.4 78.75,57.36 COMMUNICATION.4
TXD2  (via drill 0.5)
  Top 0.406: v72.61,59.6 73.67,60.66 COMMUNICATION.6
  Bottom 0.406: IC1.4 74.11,53.18 74.11,57.1 72.61,58.6 v72.61,59.6
(copper drawn outside any net)
  shapes: Bottom area x2

### Text on the board
tPlace: 9 | 8 | 7 | 6 | 5 | 4 | 3 | 2 | 1 | 0 | 22 | 13 | 12 | 11 | 10 | 14 | 15 | 16 | 17 | 18 | 19 | 20 | 21 | 24 | 26 | 28 | 30 | 31 | 32 | 33 | 34 | 35 | 36 | 37 | 38 | 39 | 40 | 41 | 42 | 43 | 44 | 45 | 46 | 47 | 48 | 49 | 50 | 51 | 52 | 53 | 0 | 1 | 2 | 3 | 4 | 5 | 6 | 7
tNames: 5V | GND | AREF | PWM | TX | RX | TX3 | RX3 | TX2 | RX2 | TX1 | RX1 | SDA | SCL | DIGITAL | ANALOG IN | IOREF | RESET | 3V3 | 5V | GND | VIN | GND